# Altium project gorilla mist project.PrjPcb
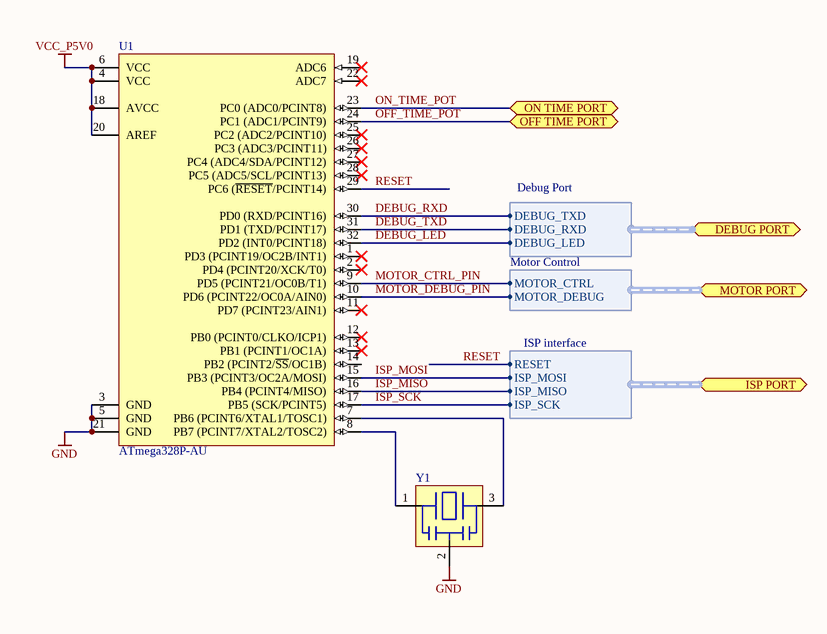
[diagram p0: microcontroller interface.SchDoc]
4 sheets, 56 parts. Net scope: flat (ports and power ports of the same name join across sheets).
Board file: Gorilla Mist PCB file.PcbDoc
Sheets:
  microcontroller interface.SchDoc
  Power Management.SchDoc
  Motor Interface.SchDoc
  User Control Interface.SchDoc

## Sheet microcontroller interface.SchDoc
size A4; Author: Azmat Bilal; Organization: Shamrock Green; Revision: 1.0.0; SheetNumber: 1; SheetTotal: 4

### Parts
U1  ATmega328P-AU  [32A_N]
Y1  CSTCE16M0V53  [CSTCE_V_C]  (value not drawn)

### Ports
DEBUG PORT (harness Debug Port), ISP PORT (harness ISP interface), MOTOR PORT (harness Motor Control), OFF TIME PORT, ON TIME PORT

### Harnesses
Debug Port: DEBUG_TXD, DEBUG_RXD, DEBUG_LED
ISP interface: RESET, ISP_MOSI, ISP_MISO, ISP_SCK
Motor Control: MOTOR_CTRL, MOTOR_DEBUG

### Nets
GND: U1.3(GND) U1.5(GND) U1.21(GND) Y1.2
VCC_P5V0: U1.4(VCC) U1.6(VCC) U1.18(AVCC) U1.20(AREF)
DEBUG_LED: U1.32(PD2_(INT0/PCINT18)) ; port DEBUG PORT.DEBUG_LED
DEBUG_RXD: U1.30(PD0_(RXD/PCINT16)) ; port DEBUG PORT.DEBUG_TXD
DEBUG_TXD: U1.31(PD1_(TXD/PCINT17)) ; port DEBUG PORT.DEBUG_RXD
ISP_MISO: U1.16(PB4_(PCINT4/MISO)) ; port ISP PORT.ISP_MISO
ISP_MOSI: U1.15(PB3_(PCINT3/OC2A/MOSI)) ; port ISP PORT.ISP_MOSI
ISP_SCK: U1.17(PB5_(SCK/PCINT5)) ; port ISP PORT.ISP_SCK
MOTOR_CTRL_PIN: U1.9(PD5_(PCINT21/OC0B/T1)) ; port MOTOR PORT.MOTOR_CTRL
MOTOR_DEBUG_PIN: U1.10(PD6_(PCINT22/OC0A/AIN0)) ; port MOTOR PORT.MOTOR_DEBUG
OFF_TIME_POT: U1.24(PC1_(ADC1/PCINT9)) ; port OFF TIME PORT
ON_TIME_POT: U1.23(PC0_(ADC0/PCINT8)) ; port ON TIME PORT
RESET: U1.29(PC6_(~{RESET}/PCINT14)) ; port ISP PORT.RESET
NetU1_7: U1.7(PB6_(PCINT6/XTAL1/TOSC1)) Y1.3
NetU1_8: U1.8(PB7_(PCINT7/XTAL2/TOSC2)) Y1.1

Not connected (* = marked no-connect by the designer): U1 1(PD3_(PCINT19/OC2B/INT1))* 2(PD4_(PCINT20/XCK/T0))* 11(PD7_(PCINT23/AIN1))* 12(PB0_(PCINT0/CLKO/ICP1))* 13(PB1_(PCINT1/OC1A))* 14(PB2_(PCINT2/~{SS}/OC1B)) 19(ADC6)* 22(ADC7)* 25(PC2_(ADC2/PCINT10))* 26(PC3_(ADC3/PCINT11))* 27(PC4_(ADC4/SDA/PCINT12))* 28(PC5_(ADC5/SCL/PCINT13))*

### Notes on the sheet
- Project:
- Auther:
- Sheet
- of
- Shamrock Green
- Date:
- Revision:
- Time:

### Library data of the parts
U1 = ATmega328P-AU: 8-bit AVR Microcontroller, 32KB Flash, 1KB EEPROM, 2KB SRAM, 32-pin TQFP, Industrial Grade (-40°C to 85°C); Published: 1-Apr-2010; DatasheetVersion: revA, Jan-2010; PackageVersion: revB, Oct-2001; PackageReference: 32A; Publisher: Altium Limited; PackageDescription: 32-Lead, 7x7x1.0 mm Body, 0.8mm Lead Pitch, Thin Profile Plastic Quad Flat Package (TQFP); Supplier 1: Digi-Key; Supplier Part Number 1: ATMEGA328P-AU-ND; Supplier 2: Farnell; Supplier Part Number 2: 1715486; Supplier 3: Mouser; Supplier Part Number 3: 556-ATMEGA328P-AU; Code_JEDEC: MS-026-ABA; ComponentLink1Description: Manufacturer Link; ComponentLink1URL: http://www.atmel.com/products/avr/default.asp?; ComponentLink2Description: ATmega48A/48PA/88A/88PA/168A/168PA/328/328P Datasheet; ComponentLink2URL: http://www.atmel.com/dyn/resources/prod_documents/8271.pdf; ComponentLink3Description: ATmega48A/48PA/88A/88PA/168A/168PA/328/328P Summary; ComponentLink3URL: http://www.atmel.com/dyn/resources/prod_documents/8271S.pdf; ComponentLink4Description: Atmel.com Home; ComponentLink4URL: http://www.atmel.com
Y1 = CSTCE16M0V53: Ceremic Resonator, 16 MHz, Built-in capacitance 15pF, SMT, 5% tolerance; datasheet: http://www.murata.com/products/catalog/pdf/p16e.pdf

## Sheet Power Management.SchDoc
size A4; Author: Azmat Bilal; Organization: Shamrock Green; Revision: 1.0.0; SheetNumber: 2; SheetTotal: 4
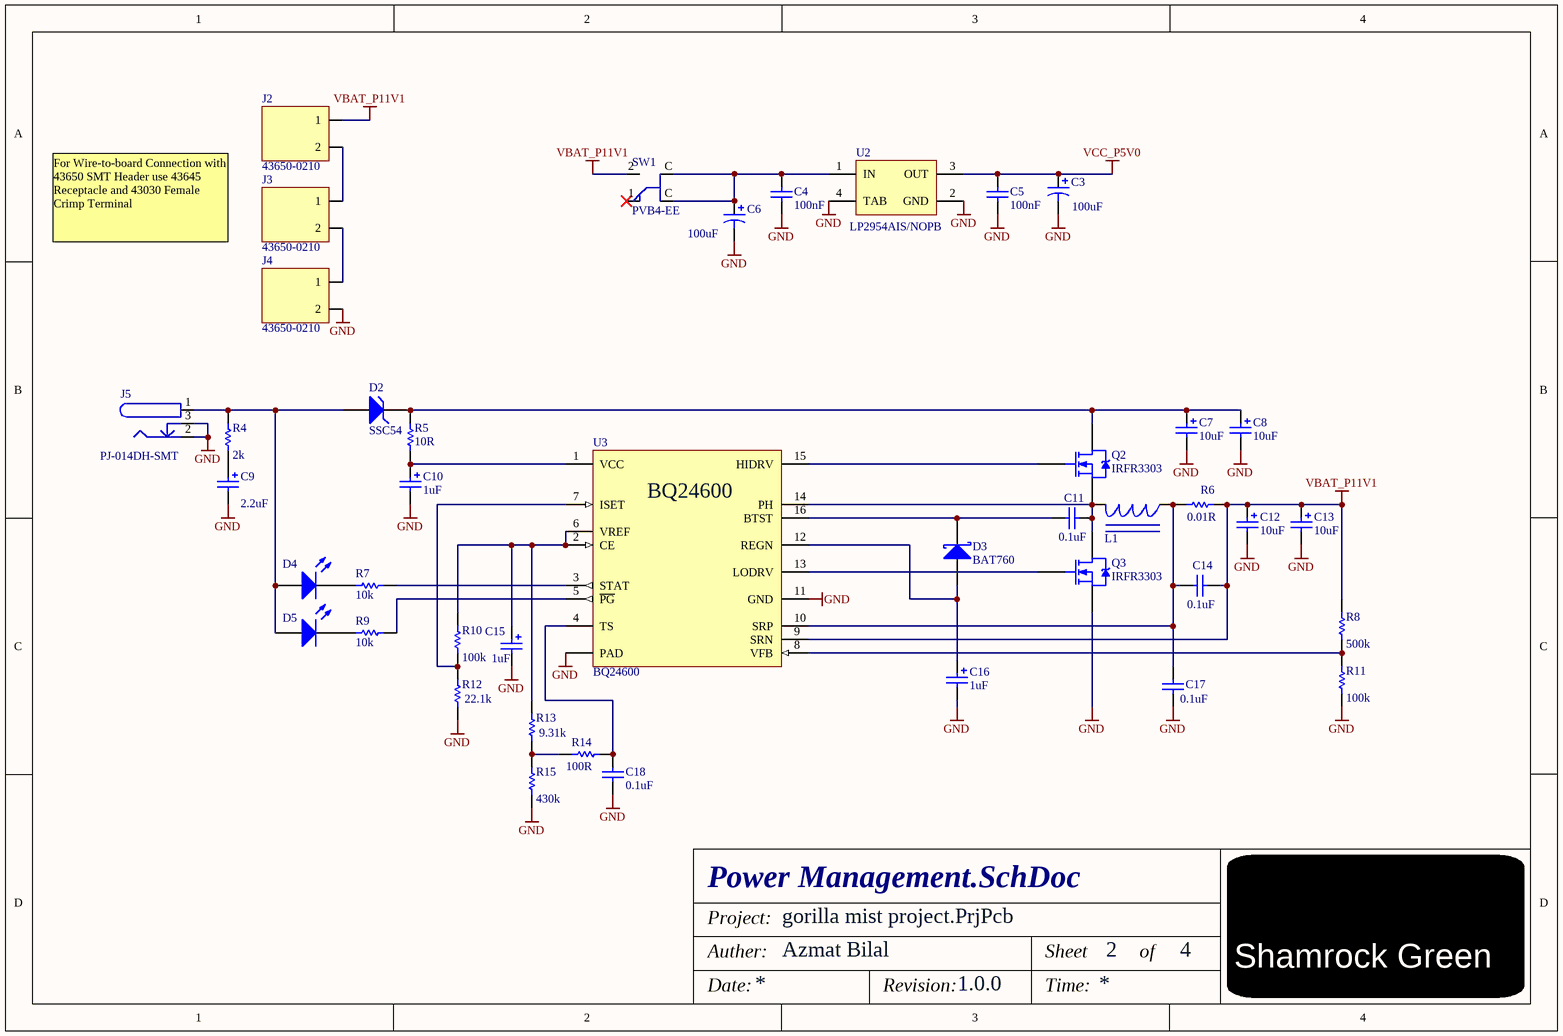
[diagram p1: Power Management.SchDoc]

### Parts
C3  value 100uF  [D]  (hidden comment: T491D107K016AT)
C4  value 100nF  [0603]  (hidden comment: C0603C104K3RACTU)
C5  value 100nF  [0603]  (hidden comment: C0603C104K3RACTU)
C6  value 100uF  [D]  (hidden comment: T491D107K016AT)
C7  value 10uF  [A]  (hidden comment: T491A106K010AT)
C8  value 10uF  [A]  (hidden comment: T491A106K010AT)
C9  value 2.2uF  [A]  (hidden comment: T491A225K010AT)
C10  value 1uF  [M]  (hidden comment: 298D106X06R3M2T)
C11  value 0.1uF  [0603]  (hidden comment: C0603C104K4RACTU)
C12  value 10uF  [A]  (hidden comment: T491A106K010AT)
C13  value 10uF  [A]  (hidden comment: T491A106K010AT)
C14  value 0.1uF  [0603]  (hidden comment: C0603C104K4RACTU)
C15  value 1uF  [M]  (hidden comment: 298D106X06R3M2T)
C16  value 1uF  [M]  (hidden comment: 298D106X06R3M2T)
C17  value 0.1uF  [0603]  (hidden comment: C0603C104K4RACTU)
C18  value 0.1uF  [0603]  (hidden comment: C0603C104K4RACTU)
D2  SSC54  [DO-214AB (SMC)]
D3  BAT760  [SOD323]
D4  HSMA-C190  [1.6X0.8X0.8]  (value not drawn)
D5  HSMG-C190  [1.6X0.8X0.8]  (value not drawn)
J2  43650-0210  [43650-0210]
J3  43650-0210  [43650-0210]
J4  43650-0210  [43650-0210]
J5  PJ-014DH-SMT  [PJ-014DH-SMT]
L1  IHLP2525CZERxRxM11  [IHLP]  (value not drawn)
Q2  IRFR3303  [TO-252AA_N]
Q3  IRFR3303  [TO-252AA_N]
R4  value 2k  [3-0603]  (hidden comment: ERJ3EKF2001V)
R5  value 10R  [8-1206]  (hidden comment: ERJ-8ENF10R0V)
R6  value 0.01R  [M1WS-2512]  (hidden comment: ERJM1WSF10MU)
R7  value 10k  [3-0603]  (hidden comment: ERJ3GEYJ103V)
R8  value 500k  [3-0603]  (hidden comment: ERJ3GEYJ514V)
R9  value 10k  [3-0603]  (hidden comment: ERJ3GEYJ103V)
R10  value 100k  [3-0603]  (hidden comment: ERJ-3GEYJ104V)
R11  value 100k  [3-0603]  (hidden comment: ERJ-3GEYJ104V)
R12  value 22.1k  [3-0603]  (hidden comment: ERJ3EKF2212V)
R13  value 9.31k  [3-0603]  (hidden comment: ERJ3EKF9311V)
R14  value 100R  [3-0603]  (hidden comment: ERJ3GEYJ101V)
R15  value 430k  [3-0603]  (hidden comment: ERJ3GEYJ434V)
SW1  PVB4-EE  [PVB4-EE]
U2  LP2954AIS/NOPB  [TS3B_N]
U3  BQ24600  [QFN16]

### Nets
GND: C3.2 C4.1 C5.1 C6.2 C7.2 C8.2 C9.2 C10.2 C12.2 C13.2 C15.2 C16.2 C17.1 C18.1 J4.2 J5.2 J5.3 Q3.3(S) R11.1 R12.1 R15.1 U2.2(GND) U2.4(TAB) U3.11(GND) U3.17(PAD)
VBAT_P11V1: C12.1 C13.1 C14.2 J2.1 R6.2 R8.2 SW1.2 U3.9(SRN)
VCC_P5V0: C3.1 C5.2 U2.3(OUT)
NetC4_2: C4.2 C6.1 SW1.C U2.1(IN)
NetC7_1: C7.1 C8.1 D2.2(K) Q2.4(D) R5.1
NetC9_1: C9.1 R4.1
NetC10_1: C10.1 R5.2 U3.1(VCC)
NetC11_1: C11.1 D3.1(K) U3.16(BTST)
NetC11_2: C11.2 L1.2 Q2.3(S) Q3.4(D) U3.14(PH)
NetC14_1: C14.1 C17.2 L1.1 R6.1 U3.10(SRP)
NetC15_1: C15.1 R10.2 R13.2 U3.2(CE) U3.6(VREF)
NetC16_1: C16.1 D3.2(A) U3.12(REGN)
NetC18_2: C18.2 R14.2 U3.4(TS)
NetD2_1: D2.1(A) D4.1(A) D5.1(A) J5.1 R4.2
NetD4_2: D4.2(K) R7.2
NetD5_2: D5.2(K) R9.2
NetJ2_2: J2.2 J3.1
NetJ3_2: J3.2 J4.1
NetQ2_1: Q2.1(G) U3.15(HIDRV)
NetQ3_1: Q3.1(G) U3.13(LODRV)
NetR7_1: R7.1 U3.3(STAT)
NetR8_1: R8.1 R11.2 U3.8(VFB)
NetR9_1: R9.1 U3.5(~{PG})
NetR10_1: R10.1 R12.2 U3.7(ISET)
NetR13_1: R13.1 R14.1 R15.2

Not connected (* = marked no-connect by the designer): SW1 1*

### Notes on the sheet
- For Wire-to-board Connection with 43650 SMT Header use 43645 Receptacle and 43030 Female Crimp Terminal
- Project:
- Auther:
- Sheet
- of
- Shamrock Green
- Date:
- Revision:
- Time:

### Library data of the parts
C3 C6 = T491D: Solid Tantalum Chip Capacitor, Standard T491 Series - Industrial Grade; Published: 17-Jul-2002; LatestRevisionDate: 19-Mar-2004; LatestRevisionNote: Silkscreen dimensions re-sized.; DatasheetDocument: Mar-2001; PackageDocument: Mar-2001; PackageReference: D; Publisher: Altium Limited; Code_JEITA: 7343-31; ComponentLink1Description: Manufacturer Link; ComponentLink1URL: http://www.kemet.com/; ComponentLink2Description: Datasheet; ComponentLink2URL: http://www.kemet.com/kemet/web/homepage/kechome.nsf/vapubfilesname/F3102TA.pdf/$file/F3102TA.pdf
C4 C5 C11 C14 C17 C18 = C0603: Ceramic Chip Capacitor - Standard; Note: Footprint corresponds to dimensions for bulk cassette packaging. This case size has tightened tolerances.; Published: 17-Jul-2002; LatestRevisionDate: 19-Mar-2004; LatestRevisionNote: Silkscreen size reduced.; DatasheetDocument: Mar-2001; PackageDocument: Mar-2001; PackageReference: 0603; Publisher: Altium Limited; Code_JEITA: 0603; Code_IPC: 1608 [0603]; ComponentLink1Description: Manufacturer Link; ComponentLink1URL: http://www.kemet.com/; ComponentLink2Description: Datasheet; ComponentLink2URL: http://www.kemet.com/kemet/web/homepage/kechome.nsf/vapubfilesname/F3102TA.pdf/$file/F3102TA.pdf
C7-C9 C12 C13 = T491A: Solid Tantalum Chip Capacitor, Standard T491 Series - Industrial Grade; Published: 17-Jul-2002; LatestRevisionDate: 19-Mar-2004; LatestRevisionNote: Silkscreen dimensions re-sized.; DatasheetDocument: Mar-2001; PackageDocument: Mar-2001; PackageReference: A; Publisher: Altium Limited; Code_JEITA: 3216-18; ComponentLink1Description: Manufacturer Link; ComponentLink1URL: http://www.kemet.com/; ComponentLink2Description: Datasheet; ComponentLink2URL: http://www.kemet.com/kemet/web/homepage/kechome.nsf/vapubfilesname/F3102TA.pdf/$file/F3102TA.pdf
C10 C15 C16 = 298D106X06R3M2T: Solid Tantalum Chip Capacitors  298D microtan, 10uF, 6.3V, 20%,  0603,
D2 = SSC54: High Current Density Schottky Rectifier, 5A, 40V, DO-214AB (SMC)
D3 = BAT760: Schottky Barrier Diode; Published: 17-Sep-2003; LatestRevisionDate: 19-Mar-2004; LatestRevisionNote: Silkscreen size reduced.; DatasheetVersion: 12-Mar-2001; PackageVersion: May-1999; PackageReference: SOD323; Publisher: Altium Limited; PackageDescription: SOD-323/SC-76; 2 Leads; Body 1.7 x 1.3 mm, (LxW); ComponentLink1Description: Manufacturer Link; ComponentLink1URL: http://www.semiconductors.philips.com/; ComponentLink2Description: Datasheet; ComponentLink2URL: http://www.semiconductors.philips.com/acrobat/datasheets/BAT760_2.pdf
D4 D5 = HSMB-C190: Blue Surface Mount Chip LED, Blue; LuminousIntensity: 1.6mcd (Minimum).; PCB_Layout: Complies with manufacturer's recommendation.; Published: 11-Dec-2002; DatasheetVersion: 26-Feb-2002; PackageVersion: Mar-2002; PackageReference: 1.6X0.8X0.8; Publisher: Altium Limited; PackageDescription: SM LED; 2 Flat Leads; LED_Colour: Blue; ComponentLink1Description: Manufacturer Link; ComponentLink1URL: http://www.avagotech.com/; ComponentLink2Description: Datasheet; ComponentLink2URL: http://cp.literature.agilent.com/litweb/pdf/5988-5211EN.pdf
J2-J4 = 43650-0210: Power Connector, Micro-Fit 3.0 Header, SMT, Single Row, Right Angle, 2 Circuits; datasheet: http://www.molex.com/pdm_docs/sd/436500210_sd.pdf; Product Series literature: http://rhu103.sma-promail.com/SQLImages/kelmscott/Molex/PDF_Images/987650-5984.pdf
J5 = PJ-014DH-SMT: DC Power Jack, 1.3 ID 3.5 OD, 3.5A, 24VDC, Normally Closed Switch, SMT, Right Angle; datasheet: http://www.cui.com/product/resource/pj-014dh-smt.pdf
L1 = IHLP2525CZ: Low Profile, High Current IHLP Inductor, 1uH to 22uH, 2.5 to 9A saturation current
Q2 Q3 = IRFR3303: HEXFET Power MOSFET; Note: Pin 2 is trimmed and is electrically connected to Drain.; Published: 8-Jun-2000; LatestRevisionDate: 20-Nov-2009; LatestRevisionNote: IPC-7351 Footprint Added.; DatasheetVersion: Aug-1997; PackageVersion: Feb-2003; PackageReference: TO-252AA; Publisher: Altium Limited; PackageDescription: 3-Pin HEXFET Package 2.28 mm Pitch, 9.9 mm Lead Span; Code_JEDEC: TO-252-AA; ComponentLink1Description: Manufacturer Link; ComponentLink1URL: http://www.irf.com/; ComponentLink2Description: Datasheet; ComponentLink2URL: http://www.irf.com/product-info/datasheets/data/irfr3303.pdf
R4 R12 R13 = ERJ3EK: Precision Thick Film Chip Resistor, 10 Ohm to 1M Ohm Range, 1% and 0.5% Tolerance, 0603 Size, 0.063 W; Published: 17-Dec-2003; LatestRevisionDate: 19-Mar-2004; LatestRevisionNote: Silkscreen size reduced.; PackageDocument: Mar-2003; PackageReference: 3-0603; Publisher: Altium Limited; Code_IPC: 1608 [0603]; ComponentLink1Description: Manufacturer Link; ComponentLink1URL: http://www.panasonic.com/industrial/components/resistive_products.htm; ComponentLink2Description: Datasheet; ComponentLink2URL: http://www.panasonic.com/industrial/components/pdf/AOA0000CE2.pdf
R5 = ERJ8EN: Precision Thick Film Chip Resistor, 10 Ohm to 2.2M Ohm Range, 1% Tolerance, 1206 Size, 0.125 W; Published: 17-Dec-2003; LatestRevisionDate: 19-Mar-2004; LatestRevisionNote: Silkscreen size reduced.; PackageDocument: Mar-2003; PackageReference: 8-1206; Publisher: Altium Limited; Code_IPC: 3216 [1206]; ComponentLink1Description: Manufacturer Link; ComponentLink1URL: http://www.panasonic.com/industrial/components/resistive_products.htm; ComponentLink2Description: Datasheet; ComponentLink2URL: http://www.panasonic.com/industrial/components/pdf/AOA0000CE2.pdf
R6 = ERJM1WS: Low Resistance Value Chip Resistor, 3m Ohm to 20m Ohm Range, 1% and 5% Tolerance, 2512 Size, 1 W; Note: See manufacturer datasheet for alternative land pattern; Published: 17-Dec-2003; LatestRevisionDate: 19-Mar-2004; LatestRevisionNote: Silkscreen size reduced.; PackageDocument: Mar-2003; PackageReference: M1WS-2512; Publisher: Altium Limited; ComponentLink1Description: Manufacturer Link; ComponentLink1URL: http://www.panasonic.com/industrial/components/resistive_products.htm; ComponentLink2Description: Datasheet; ComponentLink2URL: http://www.panasonic.com/industrial/components/pdf/AOA0000CE7.pdf
R7-R11 R14 R15 = ERJ3GE: Thick Film Chip Resistor, 1 Ohm to 10M Ohm Range, 5% Tolerance, 0603 Size, 0.1 W; Note: If flow soldering, adjust pad width of PCB Footprint to 0.7 - 0.8 times the width of the resistor.; Published: 17-Dec-2003; LatestRevisionDate: 19-Mar-2004; LatestRevisionNote: Silkscreen size reduced.; PackageDocument: Mar-2003; PackageReference: 3-0603; Publisher: Altium Limited; Code_IPC: 1608 [0603]; ComponentLink1Description: Manufacturer Link; ComponentLink1URL: http://www.panasonic.com/industrial/components/resistive_products.htm; ComponentLink2Description: Datasheet; ComponentLink2URL: http://www.panasonic.com/industrial/components/pdf/AOA0000CE1.pdf
SW1 = PVB4-EE300NSLFS: Low profile SPDT switch, SMD.
U2 = LP2954AIS/NOPB: 5V Micropower Low-Dropout Voltage Regulator, 3-pin TO-263, Pb-Free; Manufacturer: National Semiconductor; PackageTopMarking: NSUZXYTTE#*LP2954AIS; PowerWise: N; CompType: LDO IC; Published: 1-Mar-2010; DatasheetVersion: Apr-2005; PackageVersion: revF, Apr-2005; PackageReference: TS3B; Publisher: Altium Limited; PackageDescription: TO-263, Molded, .400 x .390 x .180in, 3 Lead, .1in Pitch, Surface Mount; Supplier 1: Digi-Key; Supplier Part Number 1: LP2954AIS-ND; Supplier 2: Farnell; Supplier Part Number 2: 1685547; PartNumber: LP2954AIS/NOPB; RoHS: Y; PinCount: 3; Code_JEDEC: MO-169-AA; ComponentLink1Description: LP2954A Datasheet; ComponentLink1URL: http://www.national.com/ds/LP/LP2954A.pdf; ComponentLink2Description: LP2954A Web Page; ComponentLink2URL: http://www.national.com/pf/LP/LP2954A.html; ComponentLink3Description: TS3B Package Page; ComponentLink3URL: http://www.national.com/packaging/folders/ts3b.html
U3 = BQ24600: Multi-cell Battery Charger IC, Lithium ion and Lithium Polymer, standalone.; datasheet: http://www.ti.com/lit/ds/symlink/bq24600.pdf

## Sheet Motor Interface.SchDoc
size A4; Author: Azmat Bilal; Organization: Shamrock Green; Revision: 1.0.0; SheetNumber: 3; SheetTotal: 4
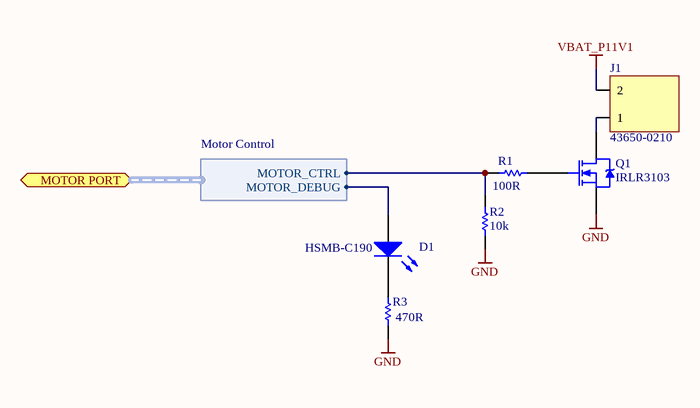
[diagram p2: Motor Interface.SchDoc]

### Parts
D1  HSMB-C190  [1.6X0.8X0.8]
J1  43650-0210  [43650-0210]
Q1  IRLR3103  [TO-252AA_N]
R1  value 100R  [3-0603]  (hidden comment: ERJ3GEYJ101V)
R2  value 10k  [3-0603]  (hidden comment: ERJ3GEYJ103V)
R3  value 470R  [3-0603]  (hidden comment: ERJ3GEYJ471V)

### Ports
MOTOR PORT (harness Motor Control)

### Harnesses
Motor Control: MOTOR_CTRL, MOTOR_DEBUG

### Nets
GND: Q1.3(S) R2.2 R3.1
VBAT_P11V1: J1.2
MOTOR_CTRL_PIN: R1.1 R2.1 ; port MOTOR PORT.MOTOR_CTRL
MOTOR_DEBUG_PIN: D1.1(A) ; port MOTOR PORT.MOTOR_DEBUG
NetD1_2: D1.2(K) R3.2
NetJ1_1: J1.1 Q1.4(D)
NetQ1_1: Q1.1(G) R1.2

### Notes on the sheet
- Project:
- Auther:
- Sheet
- of
- Shamrock Green
- Date:
- Revision:
- Time:

### Library data of the parts
D1 = HSMB-C190: as D4 on sheet Power Management; Published: 11-Dec-2002; DatasheetVersion: 26-Feb-2002; PackageVersion: Mar-2002; PackageReference: 1.6X0.8X0.8; Publisher: Altium Limited; PackageDescription: SM LED; 2 Flat Leads; LED_Colour: Blue; ComponentLink1Description: Manufacturer Link; ComponentLink1URL: http://www.avagotech.com/; ComponentLink2Description: Datasheet; ComponentLink2URL: http://cp.literature.agilent.com/litweb/pdf/5988-5211EN.pdf
J1 = 43650-0210: as J2 on sheet Power Management; datasheet: http://www.molex.com/pdm_docs/sd/436500210_sd.pdf; Product Series literature: http://rhu103.sma-promail.com/SQLImages/kelmscott/Molex/PDF_Images/987650-5984.pdf
Q1 = IRLR3103: HEXFET Power MOSFET; Note: Pin 2 is trimmed and is electrically connected to Drain.; Published: 8-Jun-2000; LatestRevisionDate: 20-Nov-2009; LatestRevisionNote: IPC-7351 Footprint Added.; DatasheetVersion: Nov-1998; PackageVersion: Feb-2003; PackageReference: TO-252AA; Publisher: Altium Limited; PackageDescription: 3-Pin HEXFET Package 2.28 mm Pitch, 9.9 mm Lead Span; Code_JEDEC: TO-252-AA; ComponentLink1Description: Manufacturer Link; ComponentLink1URL: http://www.irf.com/; ComponentLink2Description: Datasheet; ComponentLink2URL: http://www.irf.com/product-info/datasheets/data/irlr3103.pdf
R1-R3 = ERJ3GE: as R7 on sheet Power Management; Published: 17-Dec-2003; LatestRevisionDate: 19-Mar-2004; LatestRevisionNote: Silkscreen size reduced.; PackageDocument: Mar-2003; PackageReference: 3-0603; Publisher: Altium Limited; Code_IPC: 1608 [0603]; ComponentLink1Description: Manufacturer Link; ComponentLink1URL: http://www.panasonic.com/industrial/components/resistive_products.htm; ComponentLink2Description: Datasheet; ComponentLink2URL: http://www.panasonic.com/industrial/components/pdf/AOA0000CE1.pdf

## Sheet User Control Interface.SchDoc
size A4; Author: Azmat Bilal; Organization: Shamrock Green; Revision: 1.0.0; SheetNumber: 4; SheetTotal: 4
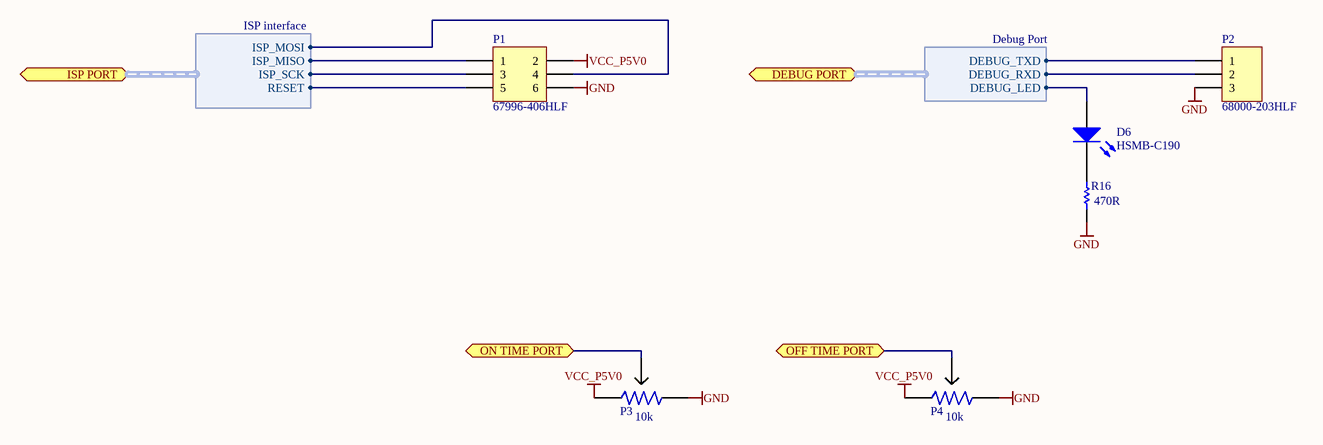
[diagram p3: User Control Interface.SchDoc]

### Parts
D6  HSMB-C190  [1.6X0.8X0.8]
P1  67996-406HLF  [HDR2X3]
P2  68000-203HLF  [HDR1X3]
P3  value 10k  [PS30-10PB10BRxxx]  (hidden comment: PS30-10PB10BR10K)
P4  value 10k  [PS30-10PB10BRxxx]  (hidden comment: PS30-10PB10BR10K)
R16  value 470R  [3-0603]  (hidden comment: ERJ3GEYJ471V)

### Ports
DEBUG PORT (harness Debug Port), ISP PORT (harness ISP interface), OFF TIME PORT, ON TIME PORT

### Harnesses
ISP interface: ISP_MISO, ISP_MOSI, ISP_SCK, RESET
Debug Port: DEBUG_LED, DEBUG_RXD, DEBUG_TXD

### Nets
GND: P1.6 P2.3 P3.3 P4.3 R16.1
VCC_P5V0: P1.2 P3.1 P4.1
DEBUG_LED: D6.1(A) ; port DEBUG PORT.DEBUG_LED
DEBUG_RXD: P2.1 ; port DEBUG PORT.DEBUG_TXD
DEBUG_TXD: P2.2 ; port DEBUG PORT.DEBUG_RXD
ISP_MISO: P1.1 ; port ISP PORT.ISP_MISO
ISP_MOSI: P1.4 ; port ISP PORT.ISP_MOSI
ISP_SCK: P1.3 ; port ISP PORT.ISP_SCK
OFF_TIME_POT: P4.2 ; port OFF TIME PORT
ON_TIME_POT: P3.2 ; port ON TIME PORT
RESET: P1.5 ; port ISP PORT.RESET
NetD6_2: D6.2(K) R16.2

### Notes on the sheet
- Project:
- Auther:
- Sheet
- of
- Shamrock Green
- Date:
- Revision:
- Time:

### Library data of the parts
D6 = HSMB-C190: as D4 on sheet Power Management; Published: 11-Dec-2002; DatasheetVersion: 26-Feb-2002; PackageVersion: Mar-2002; PackageReference: 1.6X0.8X0.8; Publisher: Altium Limited; PackageDescription: SM LED; 2 Flat Leads; LED_Colour: Blue; ComponentLink1Description: Manufacturer Link; ComponentLink1URL: http://www.avagotech.com/; ComponentLink2Description: Datasheet; ComponentLink2URL: http://cp.literature.agilent.com/litweb/pdf/5988-5211EN.pdf
P1 = Header 3X2: Header, 3-Pin, Dual row; LatestRevisionDate: 17-Jul-2002; LatestRevisionNote: Re-released for DXP Platform.; Publisher: Altium Limited
P2 = Header 3: Header, 3-Pin; LatestRevisionDate: 17-Jul-2002; LatestRevisionNote: Re-released for DXP Platform.; Publisher: Altium Limited
P3 P4 = PSxx-10PB10BRxxx: slide potentiometer
R16 = ERJ3GE: as R7 on sheet Power Management; Published: 17-Dec-2003; LatestRevisionDate: 19-Mar-2004; LatestRevisionNote: Silkscreen size reduced.; PackageDocument: Mar-2003; PackageReference: 3-0603; Publisher: Altium Limited; Code_IPC: 1608 [0603]; ComponentLink1Description: Manufacturer Link; ComponentLink1URL: http://www.panasonic.com/industrial/components/resistive_products.htm; ComponentLink2Description: Datasheet; ComponentLink2URL: http://www.panasonic.com/industrial/components/pdf/AOA0000CE1.pdf

## Nets that join several sheets
GND: microcontroller interface (U1.3 U1.5 U1.21 Y1.2), Power Management (25 pins), Motor Interface (Q1.3 R2.2 R3.1), User Control Interface (5 pins)
VBAT_P11V1: Power Management (8 pins), Motor Interface (J1.2)
VCC_P5V0: microcontroller interface (U1.4 U1.6 U1.18 U1.20), Power Management (C3.1 C5.2 U2.3), User Control Interface (P1.2 P3.1 P4.1)
DEBUG_LED: microcontroller interface (U1.32), User Control Interface (D6.1)
DEBUG_RXD: microcontroller interface (U1.30), User Control Interface (P2.1)
DEBUG_TXD: microcontroller interface (U1.31), User Control Interface (P2.2)
ISP_MISO: microcontroller interface (U1.16), User Control Interface (P1.1)
ISP_MOSI: microcontroller interface (U1.15), User Control Interface (P1.4)
ISP_SCK: microcontroller interface (U1.17), User Control Interface (P1.3)
MOTOR_CTRL_PIN: microcontroller interface (U1.9), Motor Interface (R1.1 R2.1)
MOTOR_DEBUG_PIN: microcontroller interface (U1.10), Motor Interface (D1.1)
OFF_TIME_POT: microcontroller interface (U1.24), User Control Interface (P4.2)
ON_TIME_POT: microcontroller interface (U1.23), User Control Interface (P3.2)
RESET: microcontroller interface (U1.29), User Control Interface (P1.5)